# Altium schematic sheet RP2350_QSPI.SchDoc: QSPI Memory
size Letter; Organization: NewAE Technology Inc.; Address1: 1083 Queen St., Suite 196; Address2: Halifax; Address3: NS; Address4: Canada B3H 0B2; DocumentNumber: .; Revision: .; SheetNumber: 4; SheetTotal: 4; SheetApproved: NO
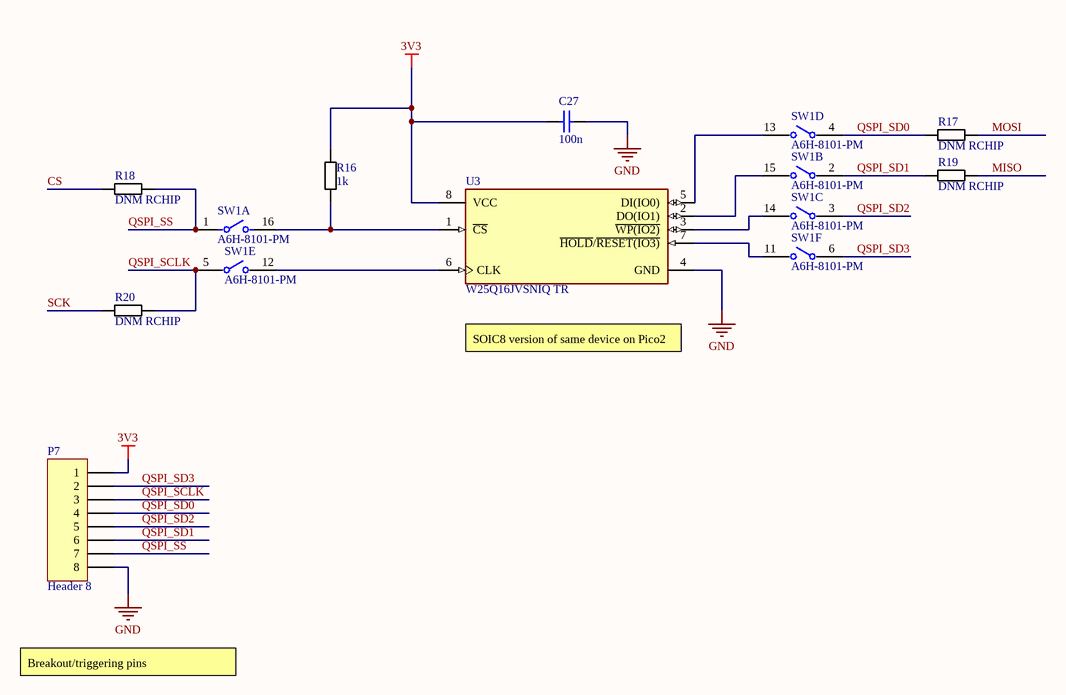
[diagram p0: RP2350_QSPI.SchDoc]

## Parts
C27  100n  [CAPC0603_M]
P7  Header 8  [HDR1X8]
R16  1k  [RESC1608X55N]
R17  DNM RCHIP  [RESC1608X55N]
R18  DNM RCHIP  [RESC1608X55N]
R19  DNM RCHIP  [RESC1608X55N]
R20  DNM RCHIP  [RESC1608X55N]
SW1  A6H-8101-PM  [FP-A6H-8101-PM-MFG]  (parts A,B,C,D,E,F of 8)
U3  W25Q16JVSNIQ TR  [FP-W25Q16JVSNIQ_TR-IPC_A]

## Nets
3V3: C27.1 P7.1 R16.1 U3.8(VCC)
GND: C27.2 P7.8 U3.4(GND)
CS: R18.1
MISO: R19.2
MOSI: R17.2
QSPI_SCLK: P7.3 R20.2 SW1.5
QSPI_SD0: P7.4 R17.1 SW1.4
QSPI_SD1: P7.6 R19.1 SW1.2
QSPI_SD2: P7.5 SW1.3
QSPI_SD3: P7.2 SW1.6
QSPI_SS: P7.7 R18.2 SW1.1
SCK: R20.1
NetR16_2: R16.2 SW1.16 U3.1(~{CS})
NetSW1_11: SW1.11 U3.7(~{HOLD}/~{RESET(IO3)})
NetSW1_12: SW1.12 U3.6(CLK)
NetSW1_13: SW1.13 U3.5(DI(IO0))
NetSW1_14: SW1.14 U3.3(~{WP(IO2)})
NetSW1_15: SW1.15 U3.2(DO(IO1))

## Notes on the sheet
- SOIC8 version of same device on Pico2
- Breakout/triggering pins
- Title:
- Date:
- Rev:
- Time:
- Project:
- Sheet
- of
- License:
- Copyright © NewAE Technology Inc.
- Approved:
- NewAE.com
- File:

## Library data of the parts
C27 = CCHIP-100n-0603: 100n, 0603; Manufacture 1: Kemet; Manufacture Part Number 1: C0603C104K5RACTU; Component Group: Capacitor; Case-EIA: 0603; Case-Metric: 1608; Rated Voltage: 50VDC; Part Number: CCHIP-100n-0603; Footprint: 0603; Pin Count: 2; Supplier 1: Digi-Key; Supplier Part Number 1: 399-5089-2-ND; Value: 100n; Mounting Technology: SMT; Component Kind: Standard; Component Type: Standard
P7 = Header 8: Header, 8-Pin; LatestRevisionDate: 17-Jul-2002; LatestRevisionNote: Re-released for DXP Platform.; Publisher: Altium Limited
R16 = RCHIP-1K-0603: 1k res, 0603, 1%, 1/10W; Manufacture 1: Yageo; Manufacture Part Number 1: RC0603FR-071KL; Component Group: Resistor; Case-EIA: 0603; Case-Metric: 1608; Rated Power: 0.1W; Rated Voltage: 75VDC; Part Number: RCHIP-1K-0603; Footprint: 0603; Pin Count: 2; Supplier 1: Digi-Key; Supplier Part Number 1: 311-1.00KHRCT-ND; Value: 1k; Tolerance: 1%; Mounting Technology: SMT; Temperature Range: -55C to 155C; Component Kind: Standard; Component Type: Standard
R17-R20 = RCHIP-DNM-0603: Do Not Mount Resistor; Case-EIA: 0603; Case-Metric: 1608; Part Number: RCHIP-DNM-0603; Component Group: Resistor; Footprint: 0603; Pin Count: 2; Mounting Technology: SMT; Component Kind: Standard; Component Type: Standard
SW1 = CMP-08827-000045-1: SWITCH SLIDE DIP SPST 25MA 24V; Number of Positions: 8; Actuator Type: Slide (Standard); Mechanical Life: 1000Cycles; Pitch: 0.05inch; Washable: No; Radiation Hardening: No; Max Operating Temperature: 70°C; Packaging: Tape and Reel; Max Current Rating: 25mA; Mount: Surface Mount; Voltage Rating (DC): 24V; Package Quantity: 4000; Length: 0.448inch; Depth: 6.7mm; Orientation: Straight; Throw Configuration: SPST; Termination: Gull Wing; Max Voltage Rating (DC): 24V; Series: A6H; Min Operating Temperature: -20°C; Current Rating: 25mA; Electrical Life: 1000Cycles
U3 = CMP-78876-000009-2: IC FLASH 16MBIT SPI/QUAD 8SOIC; NexarPartId: 75645707; Max Supply Voltage: 3.6V; Memory Size: 2MB; Interface: SPI; Access Time: 5ms; Min Supply Voltage: 2.7V; RoHS: Non-Compliant; Min Operating Temperature: -40°C; Memory Type: FLASH; Height: 1.75mm; Schedule B: 8542320070, 8542320070; Ambient Temperature Range High: 85°C; Max Operating Temperature: 85°C